# EasyEDA schematic SCH_NightLightAnnunciator_2021-09-26.json
TITLE: NightLightAnnunciator; REV: 1.0; Date: 2021-01-02; Sheet: 1/1; Drawn By: whc2001; Company: -
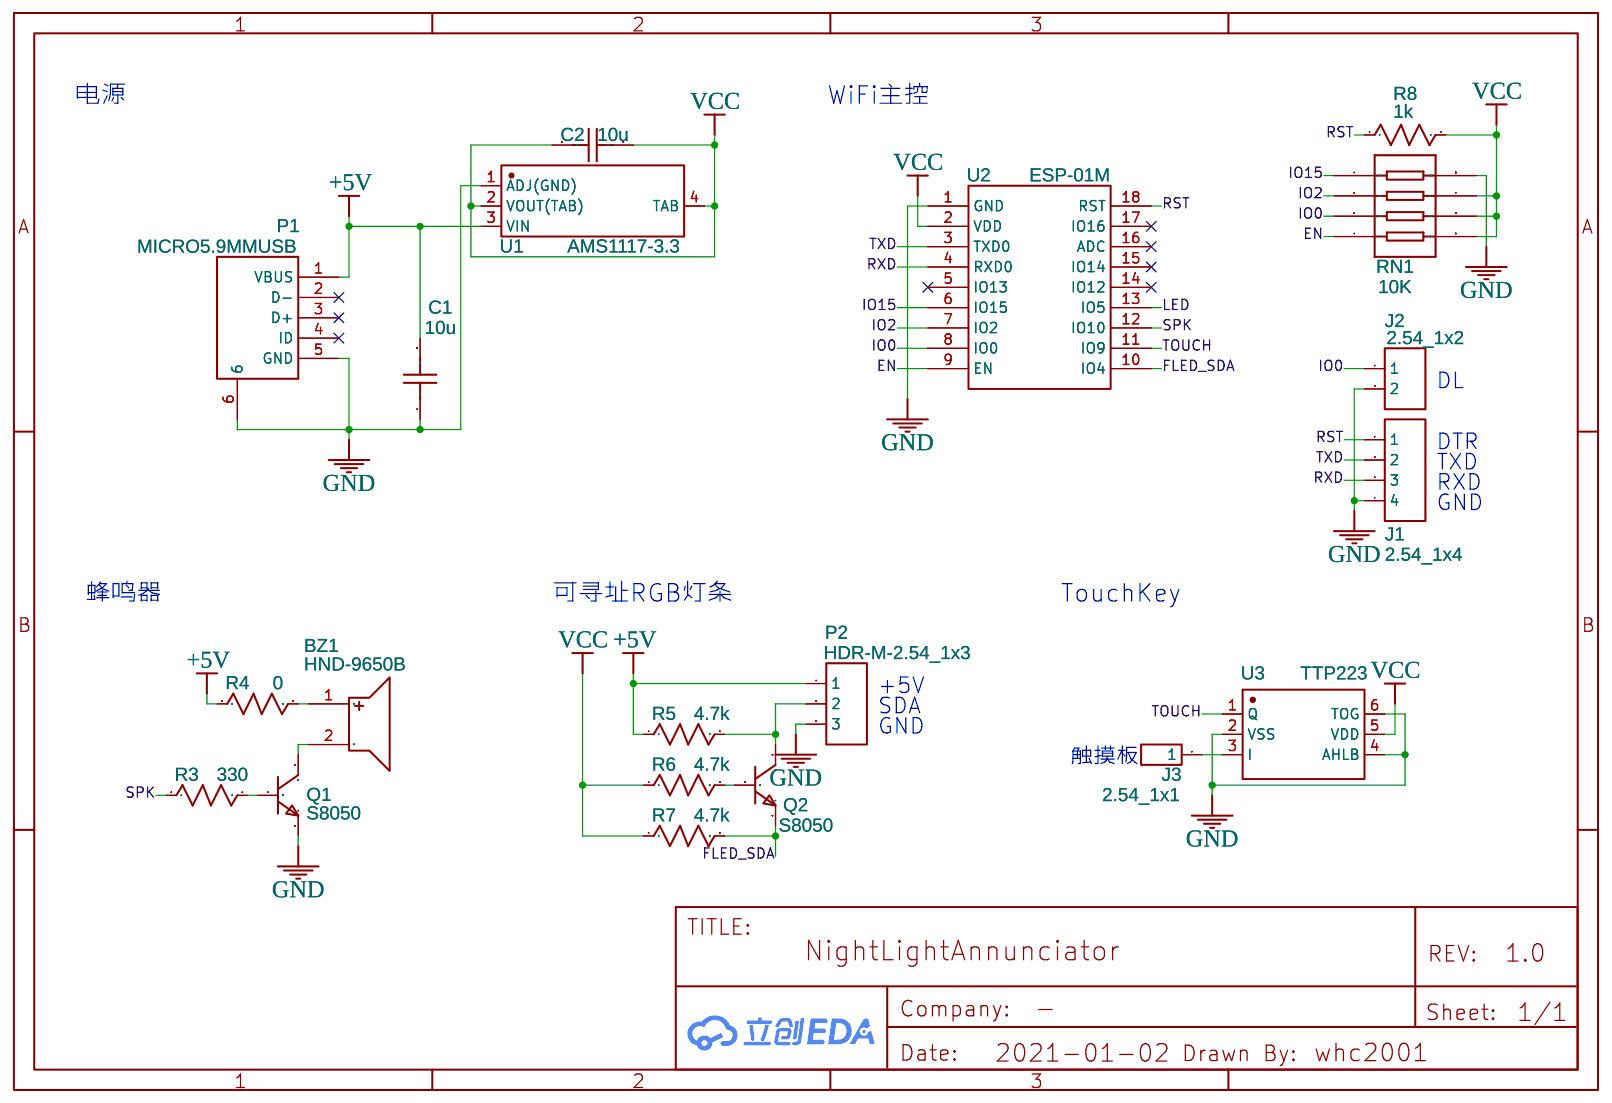
[diagram p0: schematic sheet]

## Parts
BZ1  HND-9650B  [BUZ-SMD_L9.6-W9.6-LS10.0-R]
C1  10u  [C0603]
C2  10u  [C0603]
J1  2.54_1x4  [HDR-M-2.54_1X4]
J2  2.54_1x2  [HDR-M-2.54_1X2]
J3  2.54_1x1  [HDR-M-2.54_1X1]
P1  MICRO5.9MMUSB  [MICRO-USB-SMD_5P-P0.65-H-F_MICRO5.9MMUSB]
P2  HDR-M-2.54_1x3  [HDR-M-2.54_1X3]
Q1  S8050  [SOT-23-3_L3.0-W1.7-P0.95-LS2.9-BR]
Q2  S8050  [SOT-23-3_L3.0-W1.7-P0.95-LS2.9-BR]
R3  330  [R0603]
R4  0  [R0603]
R5  4.7k  [R0603]
R6  4.7k  [R0603]
R7  4.7k  [R0603]
R8  1k  [R0603]
RN1  10K  [RES-ARRAY-SMD_0603-8P-L3.2-W1.6-BL]
U1  AMS1117-3.3  [SOT-223_L6.7-W3.5-P2.30-BR]
U2  ESP-01M  [ESP-01M]
U3  TTP223  [SOT-23-6_L2.9-W1.6-P0.95-LS2.8-BR]

## Library data of the parts
BZ1 = HND-9650B: Supplier: LCSC; Manufacturer: HNDZ; Contributor: LCSC; Supplier Part: C96127
C1 C2 = C_0603_US: Contributor: LCEDA_Lib
J1 = HDR-M-2.54_1x4: Supplier Part: C124378; Supplier: LCSC; Contributor: LCEDA_Lib
J2 = HDR-M-2.54_1x2: Supplier Part: C124375; Supplier: LCSC; Contributor: LCEDA_Lib
J3 = HDR-M-2.54_1x1: Supplier Part: C81276; Supplier: LCSC; Contributor: LCEDA_Lib
P1 = MICRO5.9MMUSB: Supplier: LCSC; Supplier Part: C393940; Manufacturer: SHOU HAN; Manufacturer Part: MICRO5.9mmusb; Contributor: LCSC
P2 = HDR-M-2.54_1x3: Supplier Part: C180248; Supplier: LCSC; Contributor: LCEDA_Lib
Q1 Q2 = S8050-J3Y: Supplier: LCSC; Supplier Part: C364312; Manufacturer: (MDD) Jiangsu Yutai Elec; Contributor: LCSC
R3-R8 = R_0603_US: Contributor: LCEDA_Lib
RN1 = CN1J4TTD103J: Supplier: LCSC; Supplier Part: C240723; Manufacturer: KOA Speer Elec; Contributor: LCSC
U1 = AMS1117-3.3_C347222: Supplier: LCSC; Supplier Part: C347222; Manufacturer: Youtai Semiconductor Co., Ltd.; Contributor: LCSC; SMT Type: Extend; JLCPCB SMD: Yes
U2 = ESP-01M: link: https://docs.ai-thinker.com/_media/esp8266/docs/esp-01m_product_specification_zh_v1.0.pdf; Contributor: whc2001
U3 = TTP223E-HA6: Supplier: LCSC; Manufacturer: TONTEK; Contributor: LCSC; Supplier Part: C129459; SMT Type: Extend; JLCPCB SMD: Yes

## Nets
+5V: C1.2 P1.1(VBUS) P2.1 R4.1 R5.1 U1.3(VIN)
GND: C1.1 J1.4 J2.2 P1.5(GND) P1.6 P2.3 Q1.2(E) RN1.8 U1.1(ADJ(GND)) U2.1(GND) U3.2(VSS) U3.4(AHLB) U3.6(TOG)
VCC: C2.1 C2.2 R6.1 R7.1 R8.2 RN1.5 RN1.6 RN1.7 U1.2(VOUT(TAB)) U1.4(TAB) U2.2(VDD) U3.5(VDD)
EN: RN1.4 U2.9(EN)
FLED_SDA: Q2.2(E) R7.2 U2.10(IO4)
IO0: J2.1 RN1.3 U2.8(IO0)
IO2: RN1.2 U2.7(IO2)
IO15: RN1.1 U2.6(IO15)
LED: U2.13(IO5)
RST: J1.1 R8.1 U2.18(RST)
RXD: J1.3 U2.4(RXD0)
SPK: R3.1 U2.12(IO10)
TOUCH: U2.11(IO9) U3.1(Q)
TXD: J1.2 U2.3(TXD0)
Net-(BZ1-1): BZ1.1 R4.2
Net-(BZ1-2): BZ1.2 Q1.3(C)
Net-(J3-1): J3.1 U3.3(I)
Net-(P2-2): P2.2 Q2.3(C) R5.2
Net-(Q1-1): Q1.1(B) R3.2
Net-(Q2-1): Q2.1(B) R6.2

Not connected (* = marked no-connect by the designer): P1 2(D-)* 3(D+)* 4(ID)*; U2 5(IO13)* 14(IO12)* 15(IO14)* 16(ADC)* 17(IO16)*

## Notes on the sheet
- 电源
- WiFi主控
- DL
- DTR
- TXD
- RXD
- GND
- 蜂鸣器
- 可寻址RGB灯条
- TouchKey
- +5V
- GND
- SDA
- 触摸板
